# Altium schematic sheet Video out.SchDoc
size A4; SheetNumber: 13; SheetTotal: 15
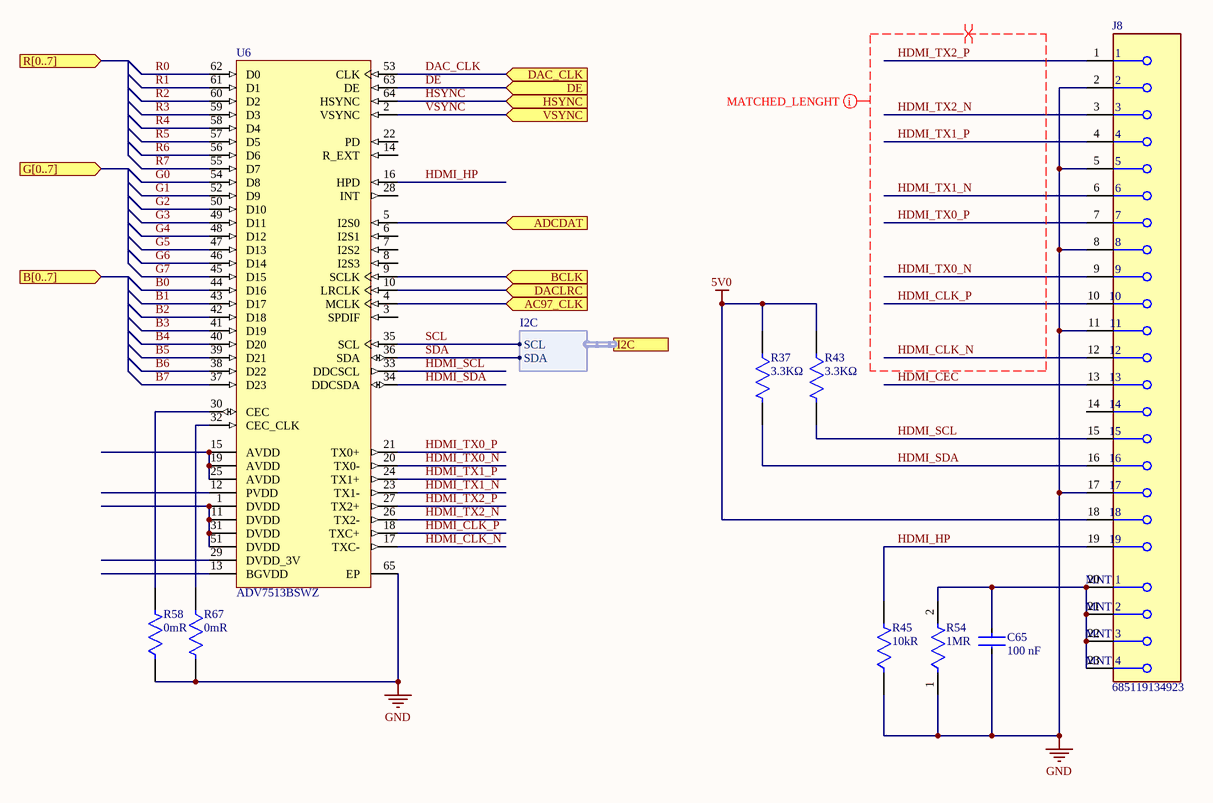
[diagram p0: Video out.SchDoc]

## Parts
C65  Capacitance: 100 nF  [FP-CC0805-0_85-IPC_A]  (hidden comment: CC0805KRX7R9BB104)
J8  685119134923  [FP-685119134923-MFG]
R37  Resistance: 3.3KΩ  [FP-RT0805-IPC_A]  (hidden comment: RT0805FRE073K3L)
R43  Resistance: 3.3KΩ  [FP-RT0805-IPC_A]  (hidden comment: RT0805FRE073K3L)
R45  Resistance: 10kR  [FP-CR0805-IPC_A]  (hidden comment: CR0805-JW-103ELF)
R54  Resistance: 1MR  [FP-ERJ6EN-IPC_A]  (hidden comment: ERJ-6ENF1004V)
R58  Resistance: 0mR  [FP-CR0805-IPC_A]  (hidden comment: CR0805-J/-000ELF)
R67  Resistance: 0mR  [FP-CR0805-IPC_A]  (hidden comment: CR0805-J/-000ELF)
U6  ADV7513BSWZ  [ADI-LQFP-64_M]

## Ports
AC97_CLK (in), ADCDAT (in), B[0..7] (in), BCLK (in), DAC_CLK (in), DACLRC (in), DE (in), G[0..7] (in), HSYNC (in), I2C (harness I2C), R[0..7] (in), VSYNC (in)

## Harnesses
I2C: SDA, SCL

## Nets
5V0: J8.18 R37.1 R43.1
GND: C65.2 J8.2 J8.5 J8.8 J8.11 J8.17 R45.1 R54.1 R58.1 R67.2 U6.65(EP)
AC97_CLK: U6.4(MCLK) ; port AC97_CLK
ADCDAT: U6.5(I2S0) ; port ADCDAT
B0: U6.44(D16)
B1: U6.43(D17)
B2: U6.42(D18)
B3: U6.41(D19)
B4: U6.40(D20)
B5: U6.39(D21)
B6: U6.38(D22)
B7: U6.37(D23)
BCLK: U6.9(SCLK) ; port BCLK
DAC_CLK: U6.53(CLK) ; port DAC_CLK
DACLRC: U6.10(LRCLK) ; port DACLRC
DE: U6.63(DE) ; port DE
G0: U6.54(D8)
G1: U6.52(D9)
G2: U6.50(D10)
G3: U6.49(D11)
G4: U6.48(D12)
G5: U6.47(D13)
G6: U6.46(D14)
G7: U6.45(D15)
HDMI_CEC: J8.13
HDMI_CLK_N: J8.12 U6.17(TXC-)
HDMI_CLK_P: J8.10 U6.18(TXC+)
HDMI_HP: J8.19 R45.2 U6.16(HPD)
HDMI_SCL: J8.15 R43.2 U6.33(DDCSCL)
HDMI_SDA: J8.16 R37.2 U6.34(DDCSDA)
HDMI_TX0_N: J8.9 U6.20(TX0-)
HDMI_TX0_P: J8.7 U6.21(TX0+)
HDMI_TX1_N: J8.6 U6.23(TX1-)
HDMI_TX1_P: J8.4 U6.24(TX1+)
HDMI_TX2_N: J8.3 U6.26(TX2-)
HDMI_TX2_P: J8.1 U6.27(TX2+)
HSYNC: U6.64(HSYNC) ; port HSYNC
R0: U6.62(D0)
R1: U6.61(D1)
R2: U6.60(D2)
R3: U6.59(D3)
R4: U6.58(D4)
R5: U6.57(D5)
R6: U6.56(D6)
R7: U6.55(D7)
SCL: U6.35(SCL) ; port I2C.SCL
SDA: U6.36(SDA) ; port I2C.SDA
VSYNC: U6.2(VSYNC) ; port VSYNC
NetC65_1: C65.1 J8.20(MNT_1) J8.21(MNT_2) J8.22(MNT_3) J8.23(MNT_4) R54.2
NetR58_2: R58.2 U6.30(CEC)
NetR67_1: R67.1 U6.32(CEC_CLK)
NetU6_1: U6.1(DVDD) U6.11(DVDD) U6.31(DVDD) U6.51(DVDD)
NetU6_15: U6.15(AVDD) U6.19(AVDD) U6.25(AVDD)

Not connected (* = marked no-connect by the designer): J8 14; U6 3(SPDIF) 6(I2S1) 7(I2S2) 8(I2S3) 12(PVDD) 13(BGVDD) 14(R_EXT) 22(PD) 28(INT) 29(DVDD_3V)

## Layout directives
differential pair: HDMI_CLK_N, HDMI_CLK_P, HDMI_TX0_N, HDMI_TX0_P, HDMI_TX1_N, HDMI_TX1_P, HDMI_TX2_N, HDMI_TX2_P
rule Matched Net Lengths [Tolerance = 10mil]; rule Matched Net Lengths [Tolerance = 5mil]: HDMI_CLK_N, HDMI_CLK_P, HDMI_TX0_N, HDMI_TX0_P, HDMI_TX1_N, HDMI_TX1_P, HDMI_TX2_N, HDMI_TX2_P

## Library data of the parts
C65 = CMP-2100-03606-3: CAP CER 0.1UF 50V X7R 0805; Manufacturer: Yageo; Value: 100 nF; Manufacturer Part Number: CC0805KRX7R9BB104; Category: Cap; Case/Package: 0805
J8 = CMP-1502-00169-2: CONN RCPT HDMI 19POS SMD R/A; Number of Positions: 19; Body Material: Plastic; Number of Ports: 1; Gender: Receptacle; Shielding: Shielded; Min Operating Temperature: -25°C; Packaging: Tape and Reel; Width: 15mm; Length: 12.15mm; Insulation Color: Black; Connector Type: HDMI; Series: WR-COM; Max Operating Temperature: 85°C; RoHS Compliant: Yes; Mount: Surface Mount; Height: 5.55mm; Features: Shielded; Number of Contacts: 19; Package Quantity: 1; Orientation: Right Angle; Contact Material: Bronze; Termination: SMD/SMT; Color: Black; Flammability Rating: UL94 V-0
R37 R43 = CMP-03412-025935-1: RES SMD 3.3K OHM 1% 1/8W 0805; Manufacturer: Yageo; Value: 3.3KΩ; Manufacturer Part Number: RT0805FRE073K3L; Category: Res; Case/Package: 0805
R45 = CMP-07231-003873-1: Thick Film Chip Resistors 0805 10kΩ 0.125W 5% 200ppm/°C; Manufacturer: Bourns; value: 10kΩ; Manufacturer Part Number: CR0805-JW-103ELF; Number of Terminations: 2; Termination: SMD/SMT; Number of Pins: 2; Case/Package: 0805; Category: Res
R54 = CMP-2001-04378-6: RES SMD 1M OHM 1% 1/8W 0805; Temperature Coefficient: 100ppm/°C; Power Rating: 125mW; Voltage Rating: 150V; Length: 2mm; Height: 0.6mm; Technology: THICK FILM; Max Operating Temperature: 155°C; Case Code (Metric): 2012; Number of Terminations: 2; Radiation Hardening: No; Package Quantity: 1; Case Code (Imperial): 0805; Tolerance: 1%; RoHS Compliant: Yes; Contact Plating: Tin; Case/Package: 0805; Max Power Dissipation: 125mW; REACH SVHC: No SVHC; Lead Free: Lead Free; Termination: SMD/SMT; Size Code: 0805; Resistance Tolerance: 1%; Construction: Rectangular; Series: ERJ; Resistor Type: Thick Film; Depth: 1.25mm; Packaging: Tape and Reel; Min Operating Temperature: -55°C; Mount: Surface Mount; Features: Automotive AEC-Q200; Voltage Rating (DC): 150V; Military Standard: Not; Width: 1.2mm; Number of Pins: 2
R58 R67 = CMP-07231-004348-1: Thick Film Chip Resistors 0805 0Ω 0.125W 5%; Manufacturer: Bourns; Case/Package: 0805; Number of Pins: 2; Termination: SMD/SMT; Manufacturer Part Number: CR0805-J/-000ELF; value: 0Ω; Category: Res
U6 = CMP-2000-05043-1: High Performance HDMI Transmitter, 165 MHz, 1.8 to 3.3 V, -25 to 85 degC, 64-Pin LQFP, RoHS, Tray; Manufacturer: AnalogDevicesInc.; Operating Supply Voltage: 1.8Vto3.3V; Brand: AnalogDevices; Number of Channels: 8Channel; Datasheet Version: Rev. A, 01/2013; Manufacturer URL: http://www.analog.com/; Type: HDMITransmitters; Product Category: VideoICs; Minimum Operating Temperature: -25C; Series: ADV7513; Mounting Style: SMD/SMT; Package / Case: LQFP-64; Maximum Operating Temperature: +85C; Datasheet URL: https://datasheet.ciiva.com/15120/getdatasheetpartid-570006-15120176.pdf; Factory Pack Quantity: 160; RoHS: Details; Packaging: Tray